# Altium schematic sheet watchdog_timer.SchDoc
size 297 x 209 mm
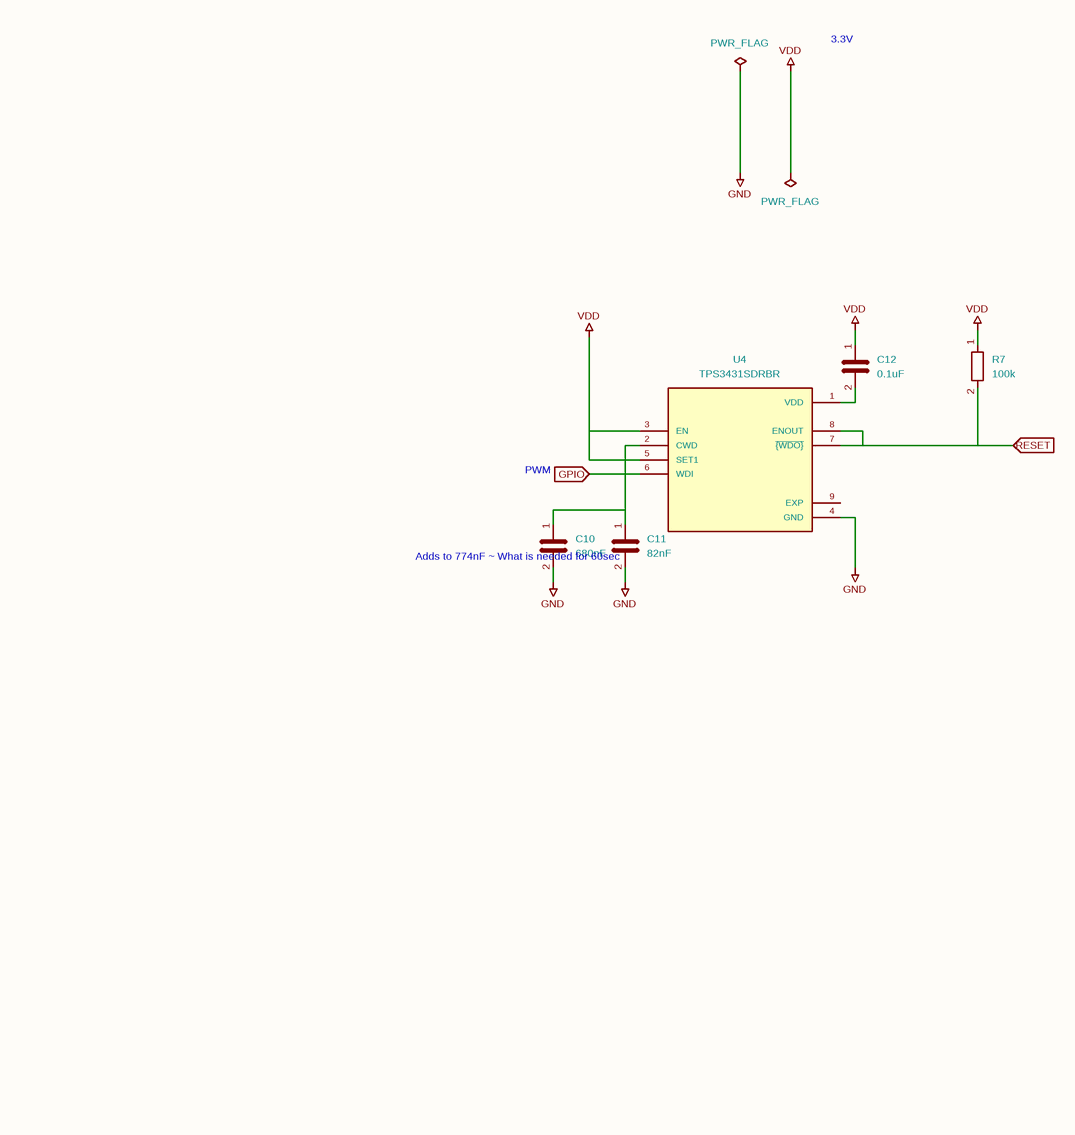
[diagram p0: watchdog_timer.SchDoc]

## Parts
#FLG01  PWR_FLAG  (graphical)
#FLG02  PWR_FLAG  (graphical)
C10  680nF  [C_1206_3216Metric]
C11  82nF  [C_1206_3216Metric]
C12  0.1uF  [C_0603_1608Metric]
R7  100k  [R_1206_3216Metric]
U4  TPS3431SDRBR  [IC_TPS3431SDRBR]

## Ports
GPIO (in), RESET (in)

## Nets
GND: #FLG01.1 C10.2 C11.2 U4.4(GND)
VDD: #FLG02.1 C12.1 R7.1 U4.3(EN) U4.5(SET1)
GPIO: U4.6(WDI) ; port GPIO
RESET: R7.2 U4.7(~{{WDO}}) U4.8(ENOUT) ; port RESET
NetC10_1: C10.1 C11.1 U4.2(CWD)
NetC12_2: C12.2 U4.1(VDD)

Not connected (* = marked no-connect by the designer): U4 9(EXP)

## Notes on the sheet
- 3.3V
- PWM IN
- Adds to 774nF ~ What is needed for 60sec
- 1
- 2
- 3
- 4
- 5
- 6
- A
- B
- C
- D
- Title:
- File: watchdog_timer.kicad_sch
- Sheet: /
- KiCad E.D.A.  kicad (5.1.4)-1
- Size: A4
- Date:
- Rev:
- Id: 1/1

## Library data of the parts
#FLG01 #FLG02 = PWR_FLAG: Description: Special symbol for telling ERC where power comes from; Value: PWR_FLAG
C10-C12 = C: Description: Unpolarized capacitor
  C10: Value: 680nF; Footprint: Capacitor_SMD:C_1206_3216Metric
  C11: Value: 82nF; Footprint: Capacitor_SMD:C_1206_3216Metric
  C12: Value: 0.1uF; Footprint: Capacitor_SMD:C_0603_1608Metric
R7 = R: Description: Resistor; Value: 100k; Footprint: Resistor_SMD:R_1206_3216Metric
U4 = TPS3431SDRBR: MANUFACTURER: Texas Instruments; PARTREV: A; STANDARD: Manufacturer Recommendations; MAXIMUM_PACKAGE_HEIGHT: 1.0 mm; Value: TPS3431SDRBR; Footprint: Footprints:IC_TPS3431SDRBR